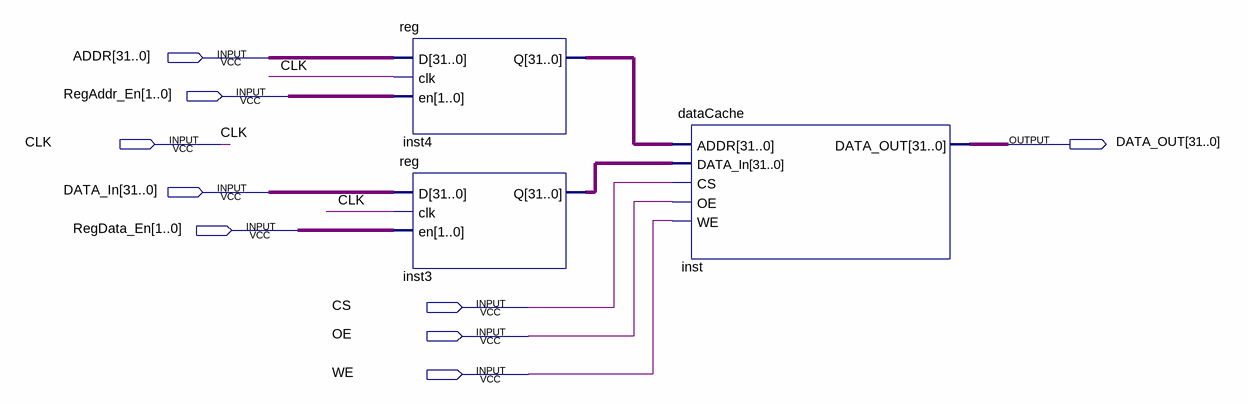
[diagram p0: schematic sheet]
// Quartus schematic DataCache_BLOCK.bdf as structural Verilog: 3 symbols, 9 pins
module DataCache_BLOCK (
  input  [31:0] ADDR,
  input  [1:0] RegAddr_En,
  input  CLK,
  input  [31:0] DATA_In,
  input  [1:0] RegData_En,
  input  CS,
  input  OE,
  input  WE,
  output [31:0] DATA_OUT
);

  wire [31:0] inst3_q, inst4_q;

  \reg  inst4 (.D(ADDR), .clk(CLK), .en(RegAddr_En), .Q(inst4_q));
  \reg  inst3 (.D(DATA_In), .clk(CLK), .en(RegData_En), .Q(inst3_q));
  dataCache inst (.ADDR(inst4_q), .DATA_In(inst3_q), .CS(CS), .OE(OE), .WE(WE), .DATA_OUT(DATA_OUT));
endmodule
